# EAGLE design device (EAGLE 8.6.0)
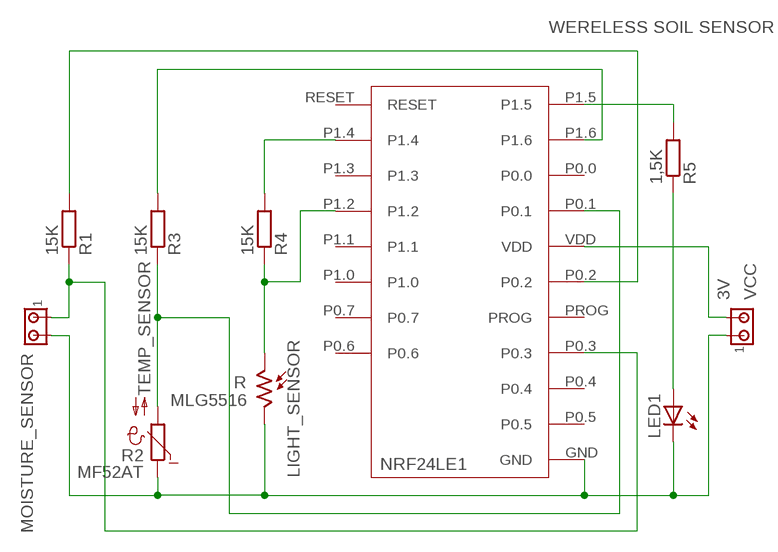
[diagram p0: schematic, sheet 1]

## Parts
LED1  LEDCHIP-LED0805  [CHIP-LED0805]
MOISTURE_SENSOR  MTA02-100  [10X02MTA]
NRF  NRF24LE1  [NRF24LE1]
R  MLG5516  A1050_09  [T0-46-A10XX]
R1  15K  R-EU_R1206  [R1206]
R2  MF52AT  NTC640  [P640]
R3  15K  R-EU_R1206  [R1206]
R4  15K  R-EU_R1206  [R1206]
R5  1,5K  R-EU_R1206  [R1206]
VCC  3V  MTA02-100  [10X02MTA]

## Nets
GND: LED1.C MOISTURE_SENSOR.2 NRF.GND R2.1 R.2 VCC.1
H: MOISTURE_SENSOR.1 NRF.P0.3 R1.1
H_V: NRF.P0.2 R1.2
L: NRF.P1.2 R4.1 R.1
L_V: NRF.P1.4 R4.2
LED: NRF.P1.5 R5.2
N$5: LED1.A R5.1
T: NRF.P0.1 R2.2 R3.1
T_V: NRF.P1.6 R3.2
VDD: NRF.VDD VCC.2
Unconnected: NRF.P0.0 NRF.P0.4 NRF.P0.5 NRF.P0.6 NRF.P0.7 NRF.P1.0 NRF.P1.1 NRF.P1.3 NRF.PROG NRF.RESET

## Notes on the sheet
- WERELESS SOIL SENSOR
- TEMP_SENSOR
- NRF24LE1
- LIGHT_SENSOR

## Library data of the parts
LED1 = led:LED: LED OSRAM: - CHIPLED LG R971, LG N971, LY N971, LG Q971, LY Q971, LO R971, LY R971 LH N974, LH R974 LS Q976, LO Q976, LY Q976 LO Q996 - Hyper CHIPLED LW Q18S LB Q993, LB Q99A, LB R99A - SideLED LS A670, LO A670, LY A670, LG A670, LP A670 LB A673, LV A673, LT A673, LW A673 LH A674 LY A675 LS A676, LA A676, LO A676, LY A676, LW A676 LS A679, LY A679, LG A679 - Hyper Micro SIDELED® LS Y876, LA Y876, LO Y876, LY Y876 LT Y87S - SmartLED LW L88C, LW L88S LB L89C, LB L89S, LG L890 LS L89K, LO L89K, LY L89K LS L896, LA L896, LO L896, LY L896 - TOPLED LS T670, LO T670, LY T670, LG T670, LP T670 LSG T670, LSP T670, LSY T670, LOP T670, LYG T670 LG T671, LOG T671, LSG T671 LB T673, LV T673, LT T673, LW T673 LH T674 LS T676, LA T676, LO T676, LY T676, LB T676, LH T676, LSB T676, LW T676 LB T67C, LV T67C, LT T67C, LS T67K, LO T67K, LY T67K, LW E67C LS E67B, LA E67B, LO E67B, LY E67B, LB E67C, LV E67C, LT E67C LW T67C LS T679, LY T679, LG T679 LS T770, LO T770, LY T770, LG T770, LP T770 LB T773, LV T773, LT T773, LW T773 LH T774 LS E675, LA E675, LY E675, LS T675 LS T776, LA T776, LO T776, LY T776, LB T776 LHGB T686 LT T68C, LB T68C - Hyper Mini TOPLED® LB M676 - Mini TOPLED Santana® LG M470 LS M47K, LO M47K, LY M47K Source: http://www.osram.convergy.de LUXEON: - LUMILED® LXK2-PW12-R00, LXK2-PW12-S00, LXK2-PW14-U00, LXK2-PW14-V00 LXK2-PM12-R00, LXK2-PM12-S00, LXK2-PM14-U00 LXK2-PE12-Q00, LXK2-PE12-R00, LXK2-PE12-S00, LXK2-PE14-T00, LXK2-PE14-U00 LXK2-PB12-K00, LXK2-PB12-L00, LXK2-PB12-M00, LXK2-PB14-N00, LXK2-PB14-P00, LXK2-PB14-Q00 LXK2-PR12-L00, LXK2-PR12-M00, LXK2-PR14-Q00, LXK2-PR14-R00 LXK2-PD12-Q00, LXK2-PD12-R00, LXK2-PD12-S00 LXK2-PH12-R00, LXK2-PH12-S00 LXK2-PL12-P00, LXK2-PL12-Q00, LXK2-PL12-R00 Source: www.luxeon.com KINGBRIGHT: KA-3528ASYC Source: www.kingbright.com
MOISTURE_SENSOR VCC = con-amp:MTA02-100: AMP connector
NRF = NRF24:NRF24LE1
R = photo-elements:A10: Sensor Robust Light Sensing Applications Outdoor Light Sensing Application Source: http://optoelectronics.perkinelmer.com/content/Datasheets/DTS_PhotocellsA1050.pdf
R1 R3-R5 = rcl:R-EU_: RESISTOR, European symbol; SPICEPREFIX: R
R2 = ptc-ntc:NTC640: PHILIPS NTC; OC_FARNELL: unknown; OC_NEWARK: unknown

## Board
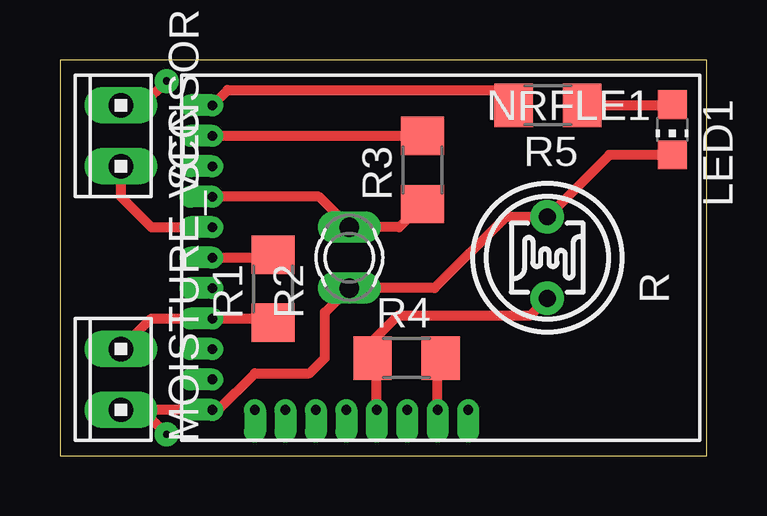
[diagram p1: board, top side]
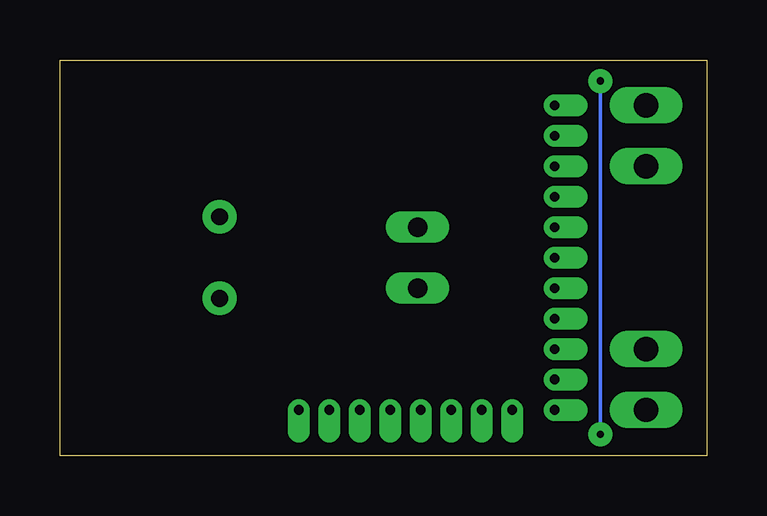
[diagram p2: board, bottom side, seen from below]

Size 26.97 x 16.5 mm. Coordinates in mm from the lower left corner, seen from the top.
Outline: 0,0 26.97,0 26.97,16.5 0,16.5 0,0
Copper layers (1*16): Top 0.035mm / dielectric 1.5mm / Bottom 0.035mm
Design rules "default": minimum track width 6mil, minimum drill 0.35mm, track to track 6mil, track to pad 6mil, pad to pad 6mil, via to via 6mil, smd to smd 6mil, copper to edge 40mil, drill to drill 6mil, minimum pad ring 10mil, minimum via ring 8mil, stop-mask expansion 4mil, vias tented up to drill 0mil, thermal gap 10mil

### Footprints (pad centres in the part's own frame; a part is rotated, then mirrored left to right if it is on the bottom)
CHIP-LED0805 = smd 1.2 x 1.2: A 0,-1.05; C 0,1.05
10X02MTA = drill 1.016 long: 1 1.27,0; 2 -1.27,0
NRF24LE1 = drill 0.4 offset: GND 6.35,-7.62; P0.0 -3.81,-7.62; P0.1 -2.54,-7.62; P0.2 0,-7.62; P0.3 2.54,-7.62; P0.4 3.81,-7.62; P0.5 5.08,-7.62; P0.6 6.35,-5.842; P0.7 6.35,-4.572; P1.0 6.35,-3.302; P1.1 6.35,-2.032; P1.2 6.35,-0.762; P1.3 6.35,0.508; P1.4 6.35,1.778; P1.5 -6.35,-7.62; P1.6 -5.08,-7.62; PROG 1.27,-7.62; RESET 6.35,3.048; VDD -1.27,-7.62
T0-46-A10XX = drill 0.7 pad 1.4: 1 -1.7,0; 2 1.7,0
R1206 = smd 1.6 x 1.803: 1 -1.422,0; 2 1.422,0
P640 = drill 0.813 long: 1 -1.27,0; 2 1.27,0

### Placement (x,y rotation side)
LED1  25.53,13.59 180 top
MOISTURE_SENSOR  2.54,3.18 90 top
NRF  13.97,8.26 270 top
R  20.32,8.26 90 top
R1  8.89,6.96 90 top
R2  12.06,8.26 90 top
R3  15.11,11.91 90 top
R4  14.45,4.06 0 top
R5  20.34,14.61 180 top
VCC  2.54,13.34 90 top

### Tracks (layer width: path | path; a pad name or v marks a point on that pad's centre or on a via)
GND  (via drill 0.3 pad 1)
  Top 0.406: LED1.C 22.9,12.54 R.2 18.59,9.96 15.62,6.98 R2.1 11.05,5.97 11.05,4.06 10.41,3.43 8.13,3.43 6.6,1.91 NRF.GND MOISTURE_SENSOR.2 3.43,1.91 v4.44,0.89 | v4.44,15.62 3.43,14.61 VCC.1
  Bottom 0.152: v4.44,0.89 v4.44,15.62
H
  Top 0.406: MOISTURE_SENSOR.1 3.81,5.72 NRF.P0.3 8.71,5.72 R1.1
H_V
  Top 0.406: NRF.P0.2 8.76,8.26 R1.2
L
  Top 0.406: NRF.P1.2 13.21,3.89 R4.1 13.03,4.78 14.1,5.84 19.61,5.84 R.1
L_V
  Top 0.406: NRF.P1.4 15.75,3.94 R4.2
LED
  Top 0.406: NRF.P1.5 6.98,15.24 18.29,15.24 R5.2
N$5
  Top 0.406: R5.1 25.49,14.61 LED1.A
T
  Top 0.406: NRF.P0.1 10.8,10.8 R2.2 14.15,9.52 R3.1
T_V
  Top 0.406: NRF.P1.6 R3.2
VDD
  Top 0.406: VCC.2 2.54,10.8 3.81,9.52 NRF.VDD